# EAGLE schematic Braind (EAGLE 6.1)
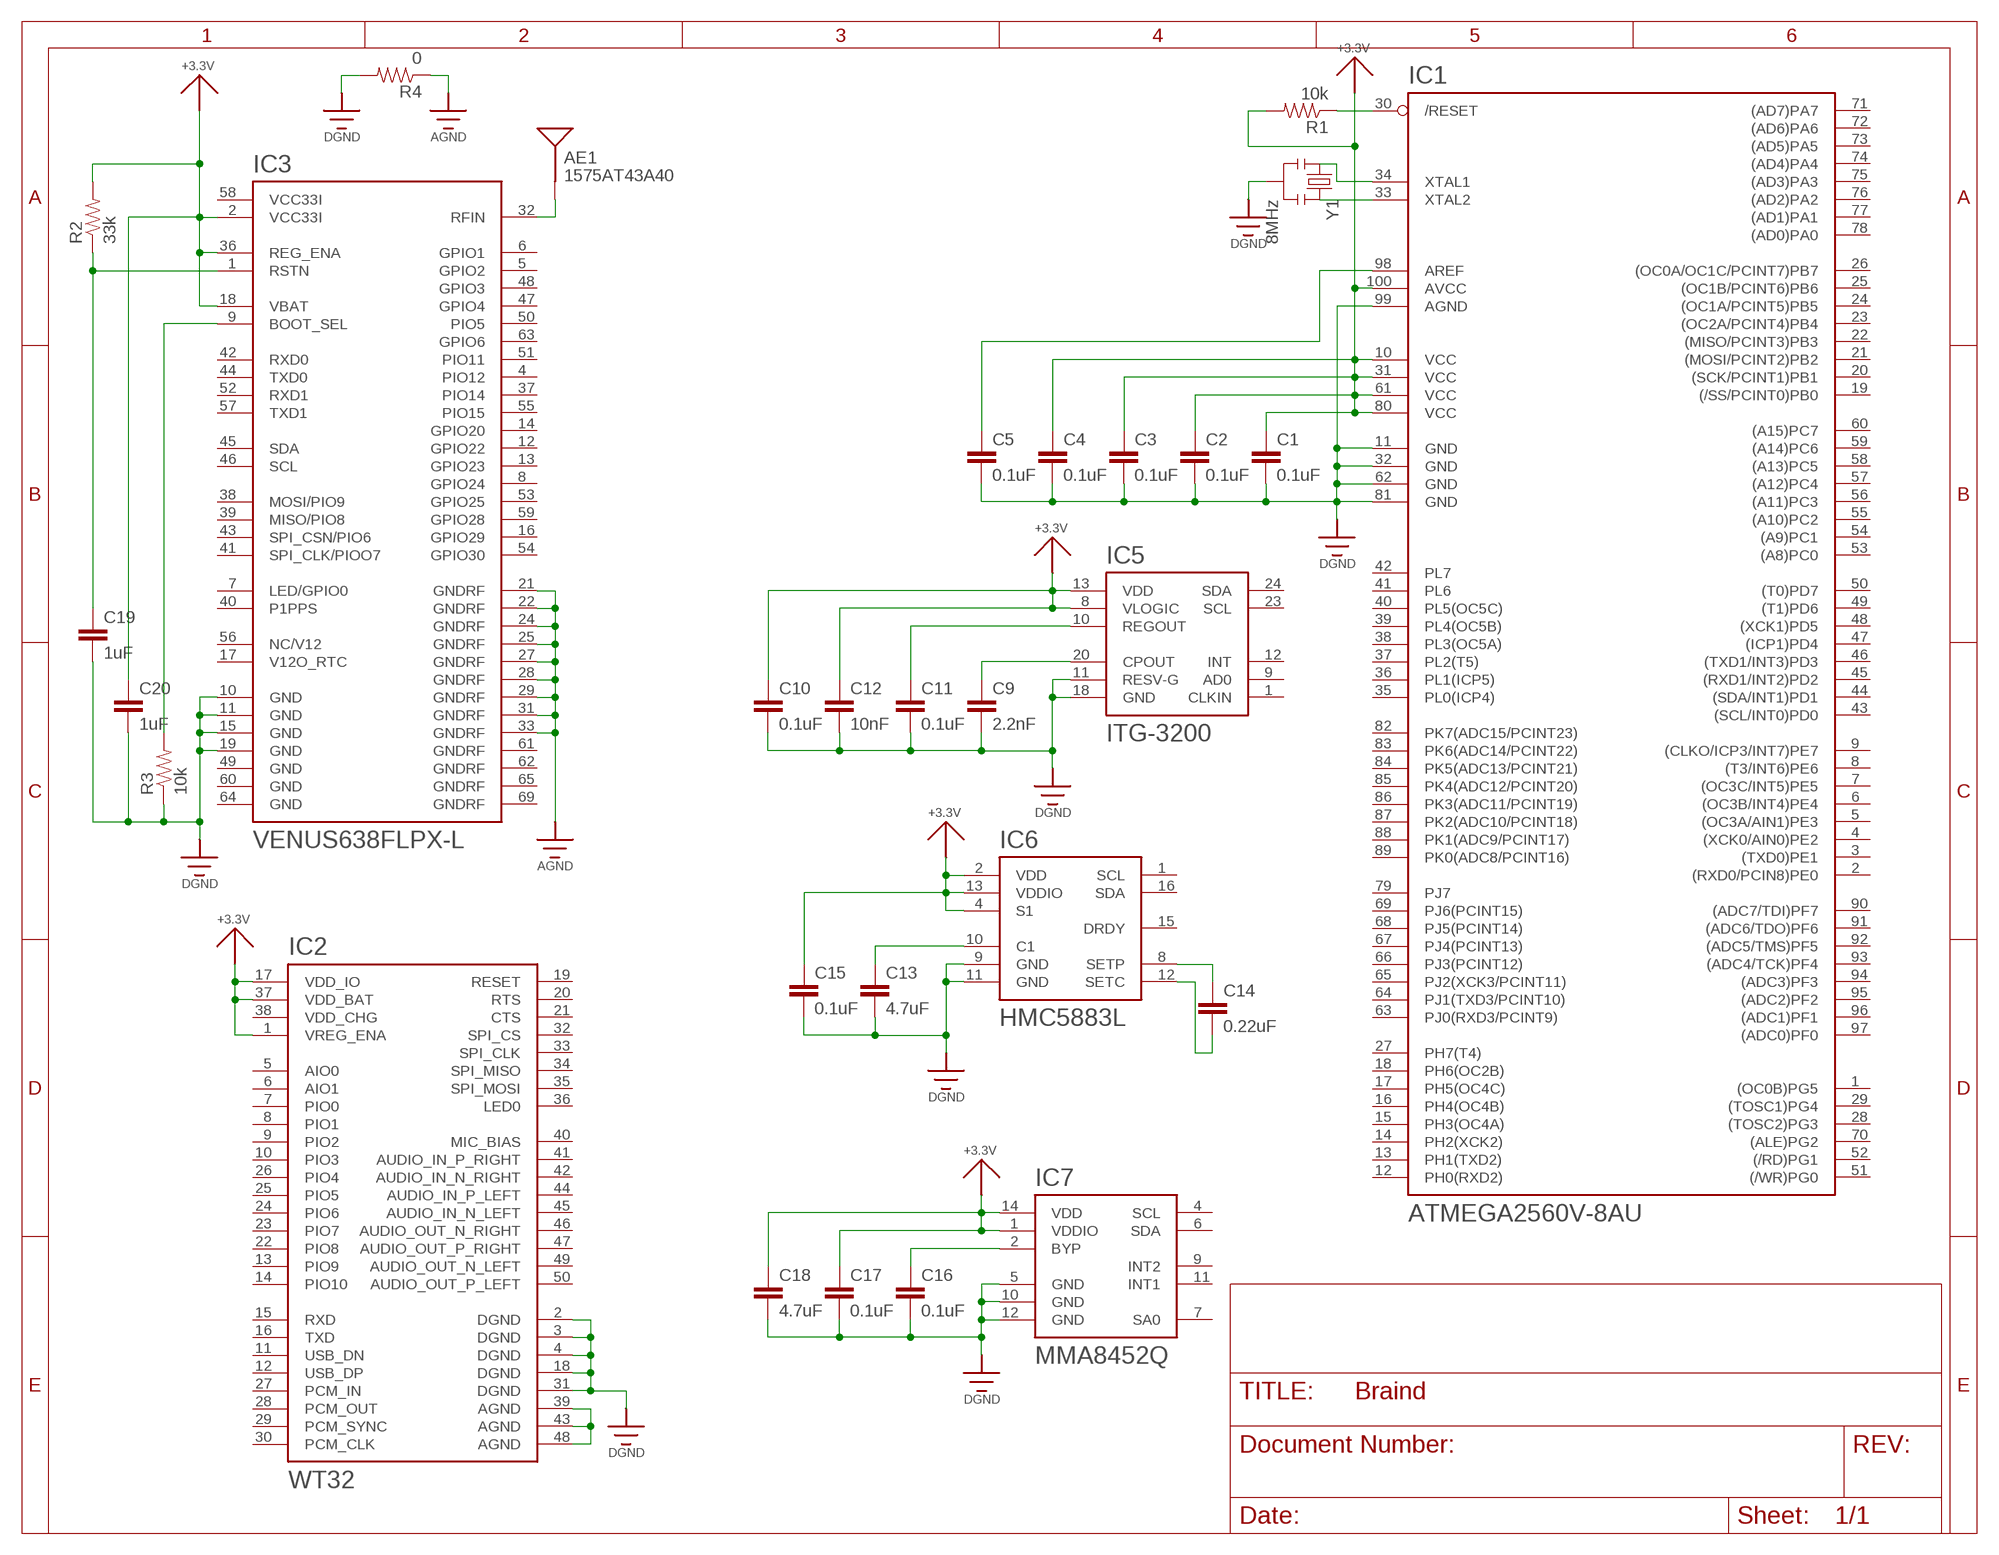
[diagram p0: schematic, sheet 1, part 1 of 2]
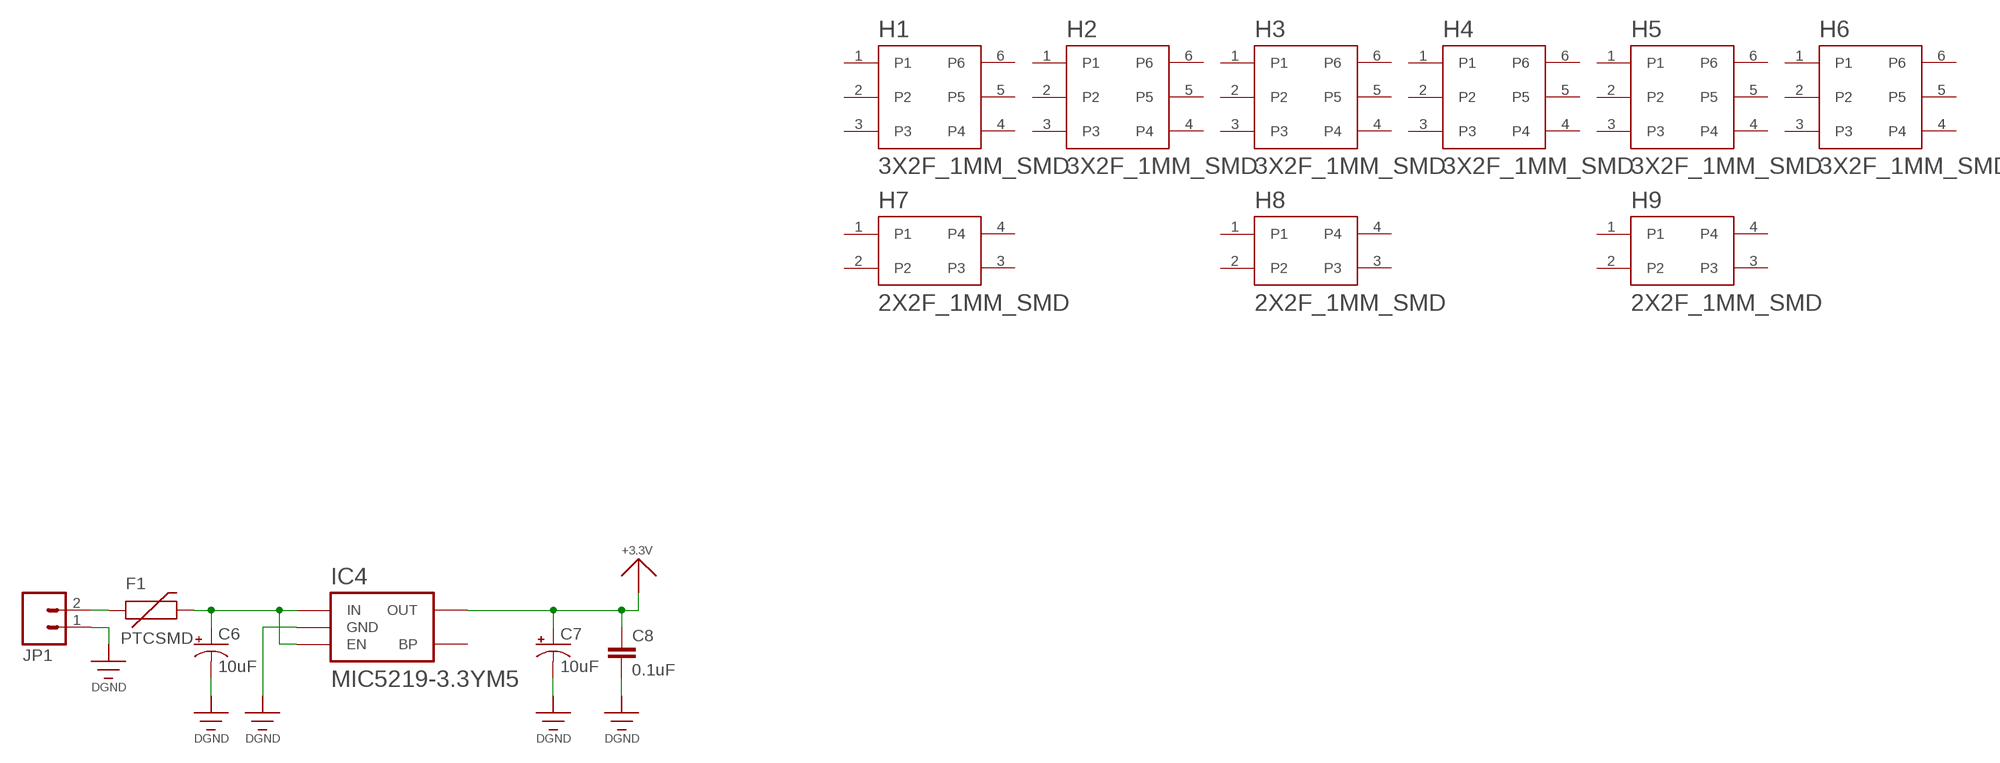
[diagram p1: schematic, sheet 1, part 2 of 2]

## Parts
AE1  1575AT43A40  [1575AT43A40]
C1  0.1uF  CAP0603-CAP  [0603-CAP]
C2  0.1uF  CAP0603-CAP  [0603-CAP]
C3  0.1uF  CAP0603-CAP  [0603-CAP]
C4  0.1uF  CAP0603-CAP  [0603-CAP]
C5  0.1uF  CAP0603-CAP  [0603-CAP]
C6  10uF  CAP_POL1206  [EIA3216]
C7  10uF  CAP_POL1206  [EIA3216]
C8  0.1uF  CAP0603-CAP  [0603-CAP]
C9  2.2nF  CAP0603-CAP  [0603-CAP]
C10  0.1uF  CAP0603-CAP  [0603-CAP]
C11  0.1uF  CAP0603-CAP  [0603-CAP]
C12  10nF  CAP0603-CAP  [0603-CAP]
C13  4.7uF  CAP0603-CAP  [0603-CAP]
C14  0.22uF  CAP0603-CAP  [0603-CAP]
C15  0.1uF  CAP0603-CAP  [0603-CAP]
C16  0.1uF  CAP0603-CAP  [0603-CAP]
C17  0.1uF  CAP0603-CAP  [0603-CAP]
C18  4.7uF  CAP0603-CAP  [0603-CAP]
C19  1uF  CAP0603-CAP  [0603-CAP]
C20  1uF  CAP0603-CAP  [0603-CAP]
F1  PTCSMD  [PTC-1206]
H1  3X2F_1MM_SMD  [3X2F_1MM_SMD]
H2  3X2F_1MM_SMD  [3X2F_1MM_SMD]
H3  3X2F_1MM_SMD  [3X2F_1MM_SMD]
H4  3X2F_1MM_SMD  [3X2F_1MM_SMD]
H5  3X2F_1MM_SMD  [3X2F_1MM_SMD]
H6  3X2F_1MM_SMD  [3X2F_1MM_SMD]
H7  2X2F_1MM_SMD  [2X2F_1MM_SMD]
H8  2X2F_1MM_SMD  [2X2F_1MM_SMD]
H9  2X2F_1MM_SMD  [2X2F_1MM_SMD]
IC1  ATMEGA2560V-8AU  [TQFP100]
IC2  WT32  [WT32]
IC3  VENUS638FLPX-L  [VENUS638FLPX]
IC4  MIC5219-3.3YM5  [SOT23-5]
IC5  ITG-3200  [QFN-24]
IC6  HMC5883L  [LPCC-16]
IC7  MMA8452Q  [QFN-COL-16]
JP1  M02-JST-2MM-SMT  [JST-2-SMD]
R1  10k  RESISTOR0603-RES  [0603-RES]
R2  33k  RESISTOR0603-RES  [0603-RES]
R3  10k  RESISTOR0603-RES  [0603-RES]
R4  0  RESISTOR0603-RES  [0603-RES]
Y1  8MHz  RESONATORSMD  [RESONATOR-SMD]

## Nets
+3.3V: IC2.1(VREG_ENA) IC2.17(VDD_IO) IC2.37(VDD_BAT)
+3V3: C1.1 C2.1 C3.1 C4.1 C7.A(+) C8.1 C10.1 C12.1 C15.1 C17.1 C18.1 C20.1 IC1.10(VCC) IC1.31(VCC) IC1.61(VCC) IC1.80(VCC) IC1.100(AVCC) IC3.2(VCC33I) IC3.18(VBAT) IC3.36(REG_ENA) IC4.5(OUT) IC5.8(VLOGIC) IC5.13(VDD) IC6.2(VDD) IC6.4(S1) IC6.13(VDDIO) IC7.1(VDDIO) IC7.14(VDD) R1.2 R2.2 ; supply symbol labelled +3.3V
AGND: R4.1
DGND: IC2.2(DGND) IC2.3(DGND) IC2.4(DGND) IC2.18(DGND) IC2.31(DGND) R4.2
GND: C1.2 C2.2 C3.2 C4.2 C5.2 C6.C(-) C7.C(-) C8.2 C9.2 C10.2 C11.2 C12.2 C13.2 C15.2 C16.2 C17.2 C18.2 C19.2 C20.2 IC1.11(GND) IC1.32(GND) IC1.62(GND) IC1.81(GND) IC1.99(AGND) IC3.10(GND) IC3.11(GND) IC3.15(GND) IC3.19(GND) IC3.21(GNDRF) IC3.22(GNDRF) IC3.24(GNDRF) IC3.25(GNDRF) IC3.27(GNDRF) IC3.28(GNDRF) IC3.29(GNDRF) IC3.31(GNDRF) IC3.33(GNDRF) IC4.2(GND) IC5.11(RESV-G) IC5.18(GND) IC6.9(GND) IC6.11(GND) IC7.5(GND) IC7.10(GND) IC7.12(GND) JP1.1 R3.1 Y1.2 ; supply symbol labelled DGND, AGND
N$1: C5.1 IC1.98(AREF)
N$2: IC1.33(XTAL2) Y1.3
N$3: IC1.34(XTAL1) Y1.1
N$4: F1.1 JP1.2
N$5: IC1.30(/RESET) R1.1
N$6: C6.A(+) F1.2 IC4.1(IN) IC4.3(EN)
N$7: IC3.9(BOOT_SEL) R3.2
N$8: IC2.39(AGND) IC2.43(AGND) IC2.48(AGND)
N$13: C13.1 IC6.10(C1)
N$14: C9.1 IC5.20(CPOUT)
N$15: C11.1 IC5.10(REGOUT)
N$17: C14.1 IC6.8(SETP)
N$18: C14.2 IC6.12(SETC)
N$19: C16.1 IC7.2(BYP)
N$22: AE1.1(SIGNAL) IC3.32(RFIN)
N$24: C19.1 IC3.1(RSTN) R2.1
Unconnected: H1.1 H1.2 H1.3 H1.4 H1.5 H1.6 H2.1 H2.2 H2.3 H2.4 H2.5 H2.6 H3.1 H3.2 H3.3 H3.4 H3.5 H3.6 H4.1 H4.2 H4.3 H4.4 H4.5 H4.6 H5.1 H5.2 H5.3 H5.4 H5.5 H5.6 H6.1 H6.2 H6.3 H6.4 H6.5 H6.6 H7.1 H7.2 H7.3 H7.4 H8.1 H8.2 H8.3 H8.4 H9.1 H9.2 H9.3 H9.4 IC1.1((OC0B)PG5) IC1.2((RXD0/PCIN8)PE0) IC1.3((TXD0)PE1) IC1.4((XCK0/AIN0)PE2) IC1.5((OC3A/AIN1)PE3) IC1.6((OC3B/INT4)PE4) IC1.7((OC3C/INT5)PE5) IC1.8((T3/INT6)PE6) IC1.9((CLKO/ICP3/INT7)PE7) IC1.12(PH0(RXD2)) IC1.13(PH1(TXD2)) IC1.14(PH2(XCK2)) IC1.15(PH3(OC4A)) IC1.16(PH4(OC4B)) IC1.17(PH5(OC4C)) IC1.18(PH6(OC2B)) IC1.19((/SS/PCINT0)PB0) IC1.20((SCK/PCINT1)PB1) IC1.21((MOSI/PCINT2)PB2) IC1.22((MISO/PCINT3)PB3) IC1.23((OC2A/PCINT4)PB4) IC1.24((OC1A/PCINT5)PB5) IC1.25((OC1B/PCINT6)PB6) IC1.26((OC0A/OC1C/PCINT7)PB7) IC1.27(PH7(T4)) IC1.28((TOSC2)PG3) IC1.29((TOSC1)PG4) IC1.35(PL0(ICP4)) IC1.36(PL1(ICP5)) IC1.37(PL2(T5)) IC1.38(PL3(OC5A)) IC1.39(PL4(OC5B)) IC1.40(PL5(OC5C)) IC1.41(PL6) IC1.42(PL7) IC1.43((SCL/INT0)PD0) IC1.44((SDA/INT1)PD1) IC1.45((RXD1/INT2)PD2) IC1.46((TXD1/INT3)PD3) IC1.47((ICP1)PD4) IC1.48((XCK1)PD5) IC1.49((T1)PD6) IC1.50((T0)PD7) IC1.51((/WR)PG0) IC1.52((/RD)PG1) IC1.53((A8)PC0) IC1.54((A9)PC1) IC1.55((A10)PC2) IC1.56((A11)PC3) IC1.57((A12)PC4) IC1.58((A13)PC5) IC1.59((A14)PC6) IC1.60((A15)PC7) IC1.63(PJ0(RXD3/PCINT9)) IC1.64(PJ1(TXD3/PCINT10)) IC1.65(PJ2(XCK3/PCINT11)) IC1.66(PJ3(PCINT12)) IC1.67(PJ4(PCINT13)) IC1.68(PJ5(PCINT14)) IC1.69(PJ6(PCINT15)) IC1.70((ALE)PG2) IC1.71((AD7)PA7) IC1.72((AD6)PA6) IC1.73((AD5)PA5) IC1.74((AD4)PA4) IC1.75((AD3)PA3) IC1.76((AD2)PA2) IC1.77((AD1)PA1) IC1.78((AD0)PA0) IC1.79(PJ7) IC1.82(PK7(ADC15/PCINT23)) IC1.83(PK6(ADC14/PCINT22)) IC1.84(PK5(ADC13/PCINT21)) IC1.85(PK4(ADC12/PCINT20)) IC1.86(PK3(ADC11/PCINT19)) IC1.87(PK2(ADC10/PCINT18)) IC1.88(PK1(ADC9/PCINT17)) IC1.89(PK0(ADC8/PCINT16)) IC1.90((ADC7/TDI)PF7) IC1.91((ADC6/TDO)PF6) IC1.92((ADC5/TMS)PF5) IC1.93((ADC4/TCK)PF4) IC1.94((ADC3)PF3) IC1.95((ADC2)PF2) IC1.96((ADC1)PF1) IC1.97((ADC0)PF0) IC2.5(AIO0) IC2.6(AIO1) IC2.7(PIO0) IC2.8(PIO1) IC2.9(PIO2) IC2.10(PIO3) IC2.11(USB_DN) IC2.12(USB_DP) IC2.13(PIO9) IC2.14(PIO10) IC2.15(RXD) IC2.16(TXD) IC2.19(RESET) IC2.20(RTS) IC2.21(CTS) IC2.22(PIO8) IC2.23(PIO7) IC2.24(PIO6) IC2.25(PIO5) IC2.26(PIO4) IC2.27(PCM_IN) IC2.28(PCM_OUT) IC2.29(PCM_SYNC) IC2.30(PCM_CLK) IC2.32(SPI_CS) IC2.33(SPI_CLK) IC2.34(SPI_MISO) IC2.35(SPI_MOSI) IC2.36(LED0) IC2.38(VDD_CHG) IC2.40(MIC_BIAS) IC2.41(AUDIO_IN_P_RIGHT) IC2.42(AUDIO_IN_N_RIGHT) IC2.44(AUDIO_IN_P_LEFT) IC2.45(AUDIO_IN_N_LEFT) IC2.46(AUDIO_OUT_N_RIGHT) IC2.47(AUDIO_OUT_P_RIGHT) IC2.49(AUDIO_OUT_N_LEFT) IC2.50(AUDIO_OUT_P_LEFT) IC3.4(PIO12) IC3.5(GPIO2) IC3.6(GPIO1) IC3.7(LED/GPIO0) IC3.8(GPIO24) IC3.12(GPIO22) IC3.13(GPIO23) IC3.14(GPIO20) IC3.16(GPIO29) IC3.17(V12O_RTC) IC3.37(PIO14) IC3.38(MOSI/PIO9) IC3.39(MISO/PIO8) IC3.40(P1PPS) IC3.41(SPI_CLK/PIOO7) IC3.42(RXD0) IC3.43(SPI_CSN/PIO6) IC3.44(TXD0) IC3.45(SDA) IC3.46(SCL) IC3.47(GPIO4) IC3.48(GPIO3) IC3.49(GND) IC3.50(PIO5) IC3.51(PIO11) IC3.52(RXD1) IC3.53(GPIO25) IC3.54(GPIO30) IC3.55(PIO15) IC3.56(NC/V12) IC3.57(TXD1) IC3.58(VCC33I) IC3.59(GPIO28) IC3.60(GND) IC3.61(GNDRF) IC3.62(GNDRF) IC3.63(GPIO6) IC3.64(GND) IC3.65(GNDRF) IC3.69(GNDRF) IC4.4(BP) IC5.1(CLKIN) IC5.9(AD0) IC5.12(INT) IC5.23(SCL) IC5.24(SDA) IC6.1(SCL) IC6.15(DRDY) IC6.16(SDA) IC7.4(SCL) IC7.6(SDA) IC7.7(SA0) IC7.9(INT2) IC7.11(INT1)

## Library data of the parts
AE1 = Customs:1575AT43A40: Chip antenna Single endded antenna. Common with smaller chip antennas. CHIP4 package is the GPS Chip Antenna SKU: GPS-08418. CHIP5 package is 2.4GHz chip antenna SKU: WRL-00144.
C1-C5 C8-C20 = SparkFun-Passives:CAP: Capacitor Standard 0603 ceramic capacitor, and 0.1" leaded capacitor.
C6 C7 = SparkFun-Passives:CAP_POL: Capacitor Polarized These are standard SMD and PTH capacitors. Normally 10uF, 47uF, and 100uF in electrolytic and tantalum varieties. Always verify the external diameter of the through hole cap, it varies with capacity, voltage, and manufacturer. The EIA devices should be standard.
F1 = SparkFun-PowerIC:PTC: Resettable Fuse PTC Resettable Fuse. Spark Fun Electronics SKU : COM-08357
H1-H6 = Customs:3X2
H7-H9 = Customs:2X2
IC1 = Customs:ATMEGA2560: Atmel 100-pin 8-bit uC 64/128/256 Kbytes FLASH 4 Kbytes EEPROM 8 Kbytes SRAM 86 General Purpose I/O pins 12-channels16-bit PWM 4 x Serial USARTs 16-channels 10-bit A/D
IC2 = Customs:WT32
IC3 = Customs:VENUS638FLPX: Venus638FLPX-L GPS Receiver Venus638FLPx is a high performance, low cost, single chip GPS receiver targeting mobile consumer and cellular handset applications. It offers very low power consumption, high sensitivity, and best in class signal acquisition and time-to-first-fix performance. Venus638FLPx contains all the necessary components of a complete GPS receiver, includes 1.2dB cascaded system NF RF front-end, GPS baseband signal processor, 0.5ppm TCXO, 32.768kHz RTC crystal, RTC LDO regulator, and passive components. It requires very low external component count and takes up only 100mm2 PCB footprint. Dedicated massive-correlator signal parameter search engine within the baseband enables rapid search of all the available satellites and acquisition of very weak signal. An advanced track engine allows weak signal tracking and positioning in harsh environments such as urban canyons and under deep foliage. The self-contained architecture keeps GPS processing off the host and allows integration into applications with very little resource. FEATURES 20Hz update rate -148dBm cold start sensitivity -165dBm tracking sensitivity 29 second cold start TTFF 3.5 second TTFF with AGPS 1 second hot start 2.5m accuracy Multipath detection and suppression Jamming detection and mitigation SBAS (WAAS / EGNOS) support 7-day extended ephemeris AGPS 67mW full power navigation Works directly with active or passive antenna Internal flash for optional 75K point data logging Supports external SPI flash memory data logging Complete receiver in 10mm x 10mm x 1.3mm size Contains LNA, SAW Filter, TCXO, RTC Xtal, LDO Pb-free RoHS compliant
IC4 = Customs:MIC5219: V_REG MIC5219 Standard 500mA LDO voltage regulator in SOT-23 layout. Micrel part MIC5219. BP (by-pass) pin is used to lower output noise with 470pF cap, may be left open.
IC5 = Customs:ITG-3200
IC6 = Customs:HMC5883L
IC7 = Customs:MMA8452Q: MMA8452Q 3-Axis, 12/8-bit Digital Accelerometer Supply Voltage: 1.6-3.6V Range: +/- 2g, 4g, 8g Interface: I2C, 12-bit and 8-bit ODR: 1.56 Hz - 800 Hz Package: QFN-16 http://cache.freescale.com/files/sensors/doc/data_sheet/MMA8452Q.pdf
JP1 = SparkFun-Connectors:M02: Header 2 Standard 2-pin 0.1" header. Use with straight break away headers (SKU : PRT-00116), right angle break away headers (PRT-00553), swiss pins (PRT-00743), machine pins (PRT-00117), and female headers (PRT-00115). Molex polarized connector foot print use with SKU : PRT-08233 with associated crimp pins and housings.
R1-R4 = SparkFun-Passives:RESISTOR: Resistor Basic schematic elements and footprints for 0603, 1206, and PTH resistors.
Y1 = SparkFun-FreqCtrl:RESONATOR: Resonator Small SMD resonator. This is the itty bitty 10/20MHz resonators with built in caps. CSTCE10M0G55 and CSTCE20M0V53. Footprint has been reviewed closely but hasn't been tested yet.